# Altium schematic sheet BLOCO_PROCESSAMENTO.SchDoc
size A3; SheetNumber: 5; SheetTotal: 8
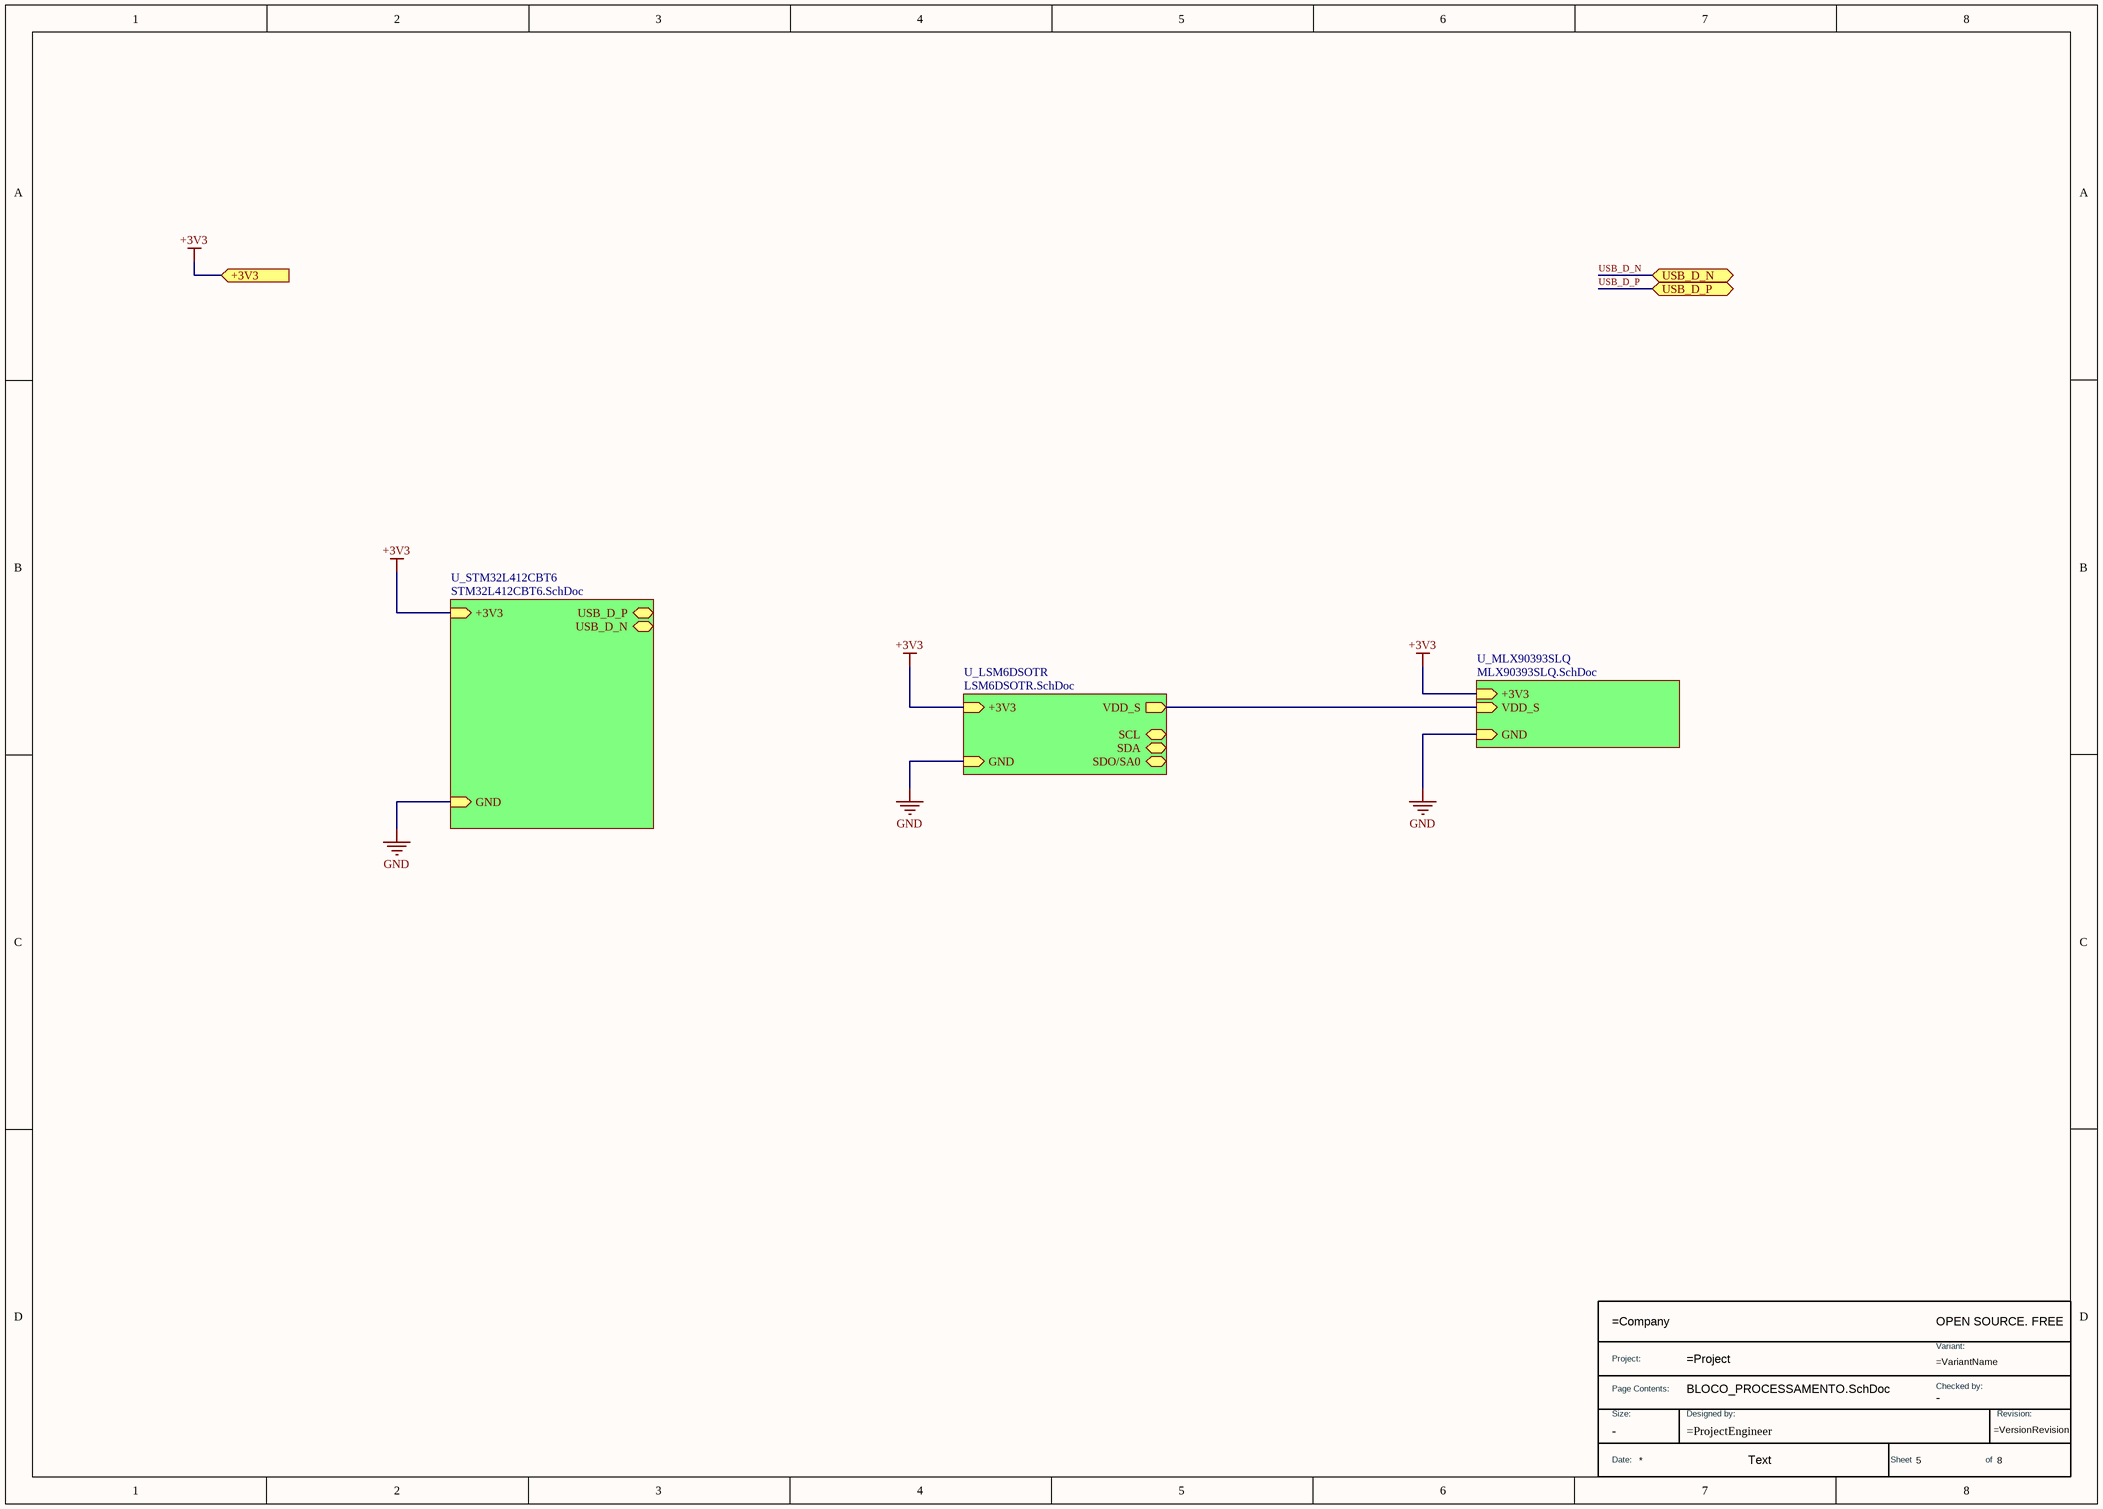
[diagram p0: BLOCO_PROCESSAMENTO.SchDoc]

## Parts
*  TitleBlock  (value not drawn)  (graphical)

## Sub-sheets
U_LSM6DSOTR = LSM6DSOTR.SchDoc: GND (in), +3V3 (in), SCL (bidir), SDA (bidir), SDO/SA0 (bidir), VDD_S (out)
U_MLX90393SLQ = MLX90393SLQ.SchDoc: VDD_S (in), GND (in), +3V3 (in)
U_STM32L412CBT6 = STM32L412CBT6.SchDoc: +3V3 (in), USB_D_P (bidir), USB_D_N (bidir), GND (in)

## Ports
+3V3 (in, see 1[6B]), USB_D_N (bidir, see 1[3B]), USB_D_P (bidir, see 1[3B])

## Nets
+3V3: port +3V3, sheet U_STM32L412CBT6/+3V3, sheet U_MLX90393SLQ/+3V3, sheet U_LSM6DSOTR/+3V3
GND: sheet U_STM32L412CBT6/GND, sheet U_MLX90393SLQ/GND, sheet U_LSM6DSOTR/GND
USB_D_N: port USB_D_N
USB_D_P: port USB_D_P
(unnamed): sheet U_MLX90393SLQ/VDD_S, sheet U_LSM6DSOTR/VDD_S

## Notes on the sheet
- Todas as informações e detalhes técnicos deste documento são de inteira propriedade da empresa V2COM,
- não poderão ser copiados, reduzidos ou cedidos a terceiros sem prévia autorização por escrito da mesma.
- Salvo em (D/M/A):
- Página:
- de
- Nome do Projeto:
- https://v2com.com/
- Ed.:
- Responsável:
- Nome da página:
- Rev.:
- Projetista:
- Obs.:
- Revisor:
- Arquivo:
- -
- (in symbol TitleBlock) OPEN SOURCE. FREE; Project:; Variant:; Page Contents:; Checked by:; Size:; Designed by:; Revision:; Date:; Text; Sheet; of

## Library data of the parts
* = TitleBlock: Standard Title Block; DWG NO: =ProjectEngineer; Size: -; Checked by: -